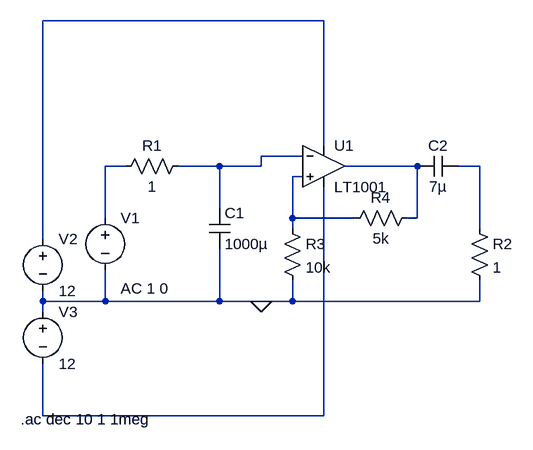
[diagram p0: schematic ex4b.asc]
ex4b.asc, the LTspice schematic file:
Version 4
SHEET 1 880 680
WIRE 144 -192 -288 -192
WIRE 144 0 144 -192
WIRE 112 16 48 16
WIRE -160 32 -192 32
WIRE -16 32 -80 32
WIRE 48 32 48 16
WIRE 48 32 -16 32
WIRE 288 32 176 32
WIRE 384 32 352 32
WIRE 112 48 96 48
WIRE -16 96 -16 32
WIRE -192 112 -192 32
WIRE 96 112 96 48
WIRE 192 112 96 112
WIRE 288 112 288 32
WIRE 288 112 272 112
WIRE 96 128 96 112
WIRE 384 128 384 32
WIRE -288 144 -288 -192
WIRE -288 240 -288 224
WIRE -192 240 -192 192
WIRE -192 240 -288 240
WIRE -16 240 -16 160
WIRE -16 240 -192 240
WIRE 48 240 -16 240
WIRE 96 240 96 208
WIRE 96 240 48 240
WIRE 384 240 384 208
WIRE 384 240 96 240
WIRE -288 256 -288 240
WIRE -288 416 -288 336
WIRE 144 416 144 64
WIRE 144 416 -288 416
FLAG 48 240 0
SYMBOL res -176 48 R270
WINDOW 0 32 56 VTop 2
WINDOW 3 0 56 VBottom 2
SYMATTR InstName R1
SYMATTR Value 1
SYMBOL cap -32 96 R0
SYMATTR InstName C1
SYMATTR Value 1000µ
SYMBOL res 368 112 R0
SYMATTR InstName R2
SYMATTR Value 1
SYMBOL cap 288 48 R270
WINDOW 0 32 32 VTop 2
WINDOW 3 0 32 VBottom 2
SYMATTR InstName C2
SYMATTR Value 7µ
SYMBOL voltage -192 96 R0
WINDOW 123 24 124 Left 2
WINDOW 39 0 0 Left 2
SYMATTR Value2 AC 1 0
SYMATTR InstName V1
SYMATTR Value ""
SYMBOL Opamps\\LT1001 144 -32 R0
SYMATTR InstName U1
SYMBOL voltage -288 128 R0
WINDOW 123 0 0 Left 2
WINDOW 39 0 0 Left 2
SYMATTR InstName V2
SYMATTR Value 12
SYMBOL voltage -288 240 R0
WINDOW 123 0 0 Left 2
WINDOW 39 0 0 Left 2
SYMATTR InstName V3
SYMATTR Value 12
SYMBOL res 80 112 R0
SYMATTR InstName R3
SYMATTR Value 10k
SYMBOL res 288 96 R90
WINDOW 0 0 56 VBottom 2
WINDOW 3 32 56 VTop 2
SYMATTR InstName R4
SYMATTR Value 5k
TEXT -322 422 Left 2 !.ac dec 10 1 1meg

The netlist it stands for:
* ex4b.asc
R1 N003 N002 1
C1 N002 0 1000µ
R2 N005 0 1
C2 N004 N005 7µ
V1 N003 0 AC 1 0
XU1 N006 N002 N001 N007 N004 LT1001  ; pins In+ In- V+ V- OUT
V2 N001 0 12
V3 0 N007 12
R3 N006 0 10k
R4 N004 N006 5k
.ac dec 10 1 1meg
.lib LTC.lib
.backanno
.end